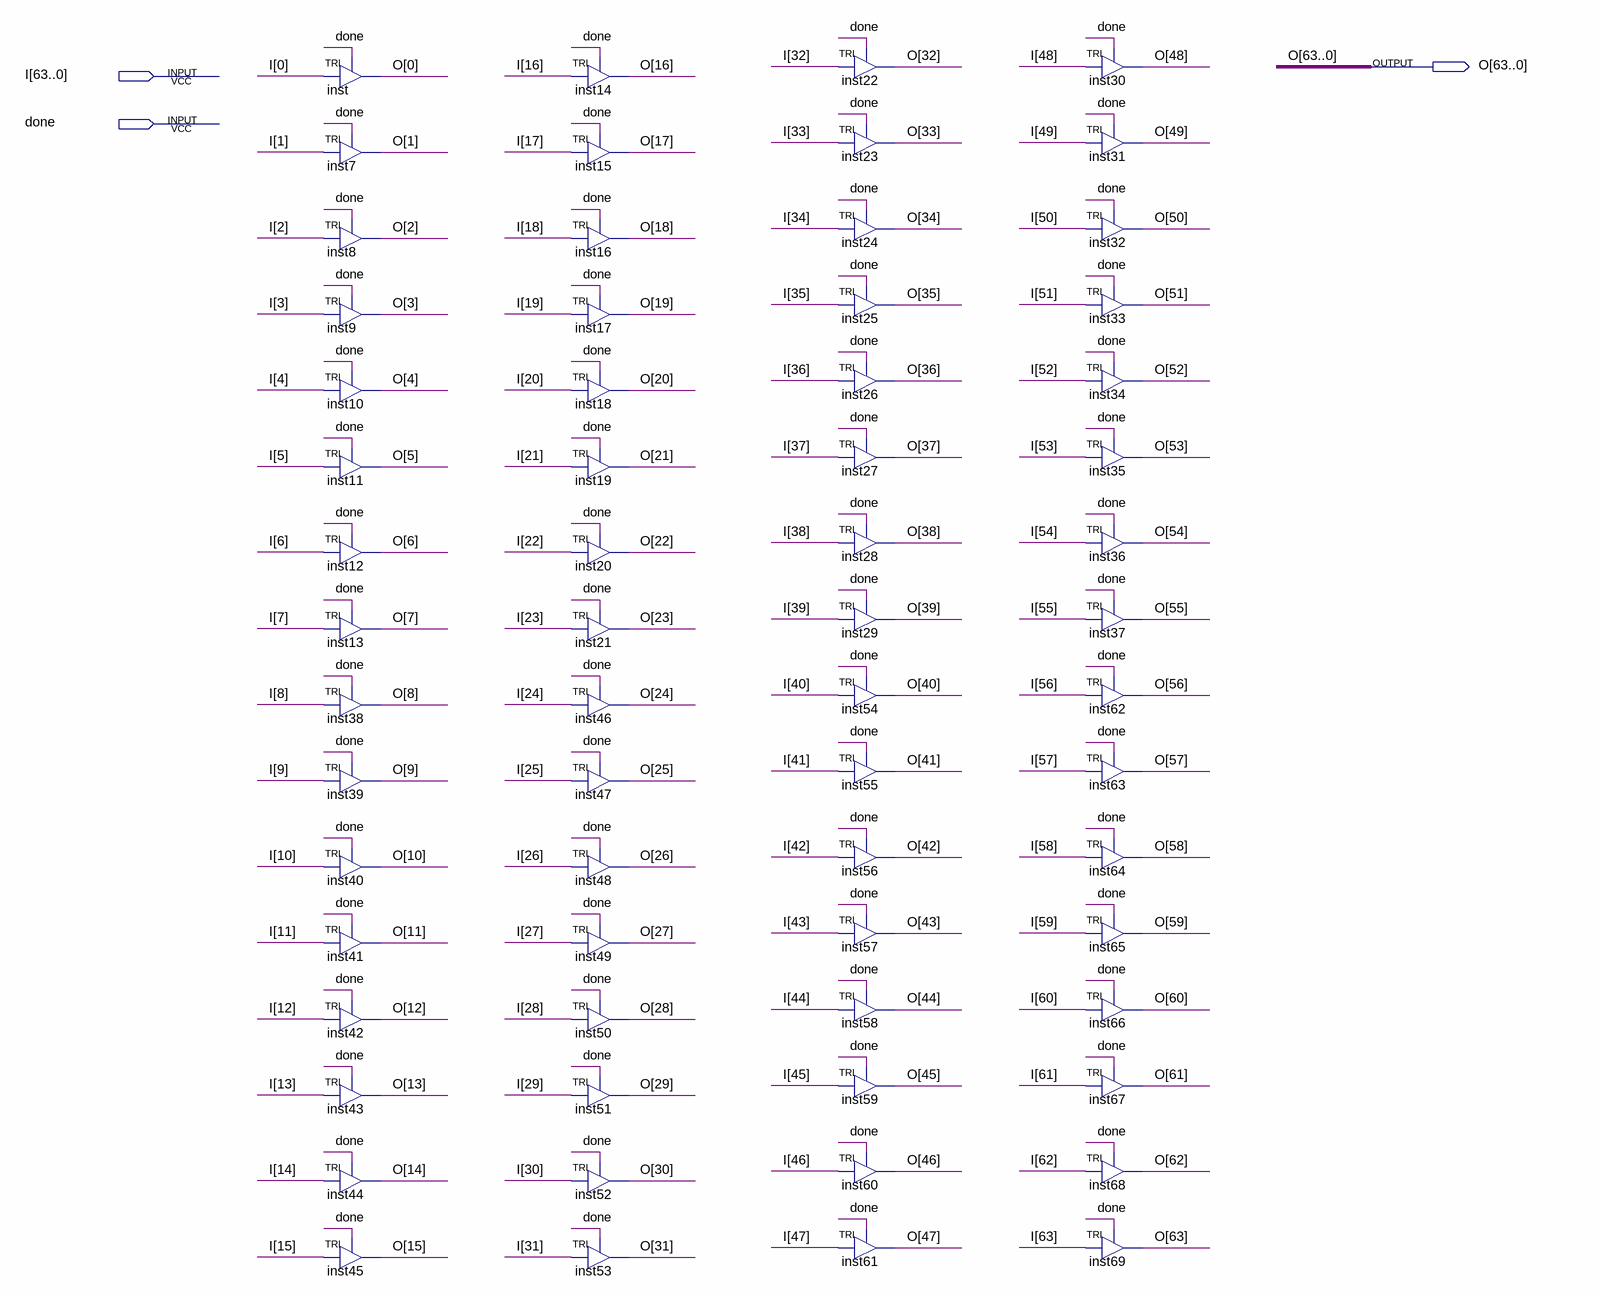
[diagram p0: schematic sheet]
// Quartus schematic TRI_64_bit.bdf as structural Verilog: 64 symbols, 3 pins
module TRI_64_bit (
  input  [63:0] I,
  input  done,
  output [63:0] O
);

  TRI inst (.IN(I[0]), .OE(done), .OUT(O[0]));
  TRI inst7 (.IN(I[1]), .OE(done), .OUT(O[1]));
  TRI inst8 (.IN(I[2]), .OE(done), .OUT(O[2]));
  TRI inst9 (.IN(I[3]), .OE(done), .OUT(O[3]));
  TRI inst10 (.IN(I[4]), .OE(done), .OUT(O[4]));
  TRI inst11 (.IN(I[5]), .OE(done), .OUT(O[5]));
  TRI inst12 (.IN(I[6]), .OE(done), .OUT(O[6]));
  TRI inst13 (.IN(I[7]), .OE(done), .OUT(O[7]));
  TRI inst38 (.IN(I[8]), .OE(done), .OUT(O[8]));
  TRI inst39 (.IN(I[9]), .OE(done), .OUT(O[9]));
  TRI inst40 (.IN(I[10]), .OE(done), .OUT(O[10]));
  TRI inst41 (.IN(I[11]), .OE(done), .OUT(O[11]));
  TRI inst42 (.IN(I[12]), .OE(done), .OUT(O[12]));
  TRI inst43 (.IN(I[13]), .OE(done), .OUT(O[13]));
  TRI inst44 (.IN(I[14]), .OE(done), .OUT(O[14]));
  TRI inst45 (.IN(I[15]), .OE(done), .OUT(O[15]));
  TRI inst14 (.IN(I[16]), .OE(done), .OUT(O[16]));
  TRI inst15 (.IN(I[17]), .OE(done), .OUT(O[17]));
  TRI inst16 (.IN(I[18]), .OE(done), .OUT(O[18]));
  TRI inst17 (.IN(I[19]), .OE(done), .OUT(O[19]));
  TRI inst18 (.IN(I[20]), .OE(done), .OUT(O[20]));
  TRI inst19 (.IN(I[21]), .OE(done), .OUT(O[21]));
  TRI inst20 (.IN(I[22]), .OE(done), .OUT(O[22]));
  TRI inst21 (.IN(I[23]), .OE(done), .OUT(O[23]));
  TRI inst46 (.IN(I[24]), .OE(done), .OUT(O[24]));
  TRI inst47 (.IN(I[25]), .OE(done), .OUT(O[25]));
  TRI inst48 (.IN(I[26]), .OE(done), .OUT(O[26]));
  TRI inst49 (.IN(I[27]), .OE(done), .OUT(O[27]));
  TRI inst50 (.IN(I[28]), .OE(done), .OUT(O[28]));
  TRI inst51 (.IN(I[29]), .OE(done), .OUT(O[29]));
  TRI inst52 (.IN(I[30]), .OE(done), .OUT(O[30]));
  TRI inst53 (.IN(I[31]), .OE(done), .OUT(O[31]));
  TRI inst22 (.IN(I[32]), .OE(done), .OUT(O[32]));
  TRI inst23 (.IN(I[33]), .OE(done), .OUT(O[33]));
  TRI inst24 (.IN(I[34]), .OE(done), .OUT(O[34]));
  TRI inst25 (.IN(I[35]), .OE(done), .OUT(O[35]));
  TRI inst26 (.IN(I[36]), .OE(done), .OUT(O[36]));
  TRI inst27 (.IN(I[37]), .OE(done), .OUT(O[37]));
  TRI inst28 (.IN(I[38]), .OE(done), .OUT(O[38]));
  TRI inst29 (.IN(I[39]), .OE(done), .OUT(O[39]));
  TRI inst54 (.IN(I[40]), .OE(done), .OUT(O[40]));
  TRI inst55 (.IN(I[41]), .OE(done), .OUT(O[41]));
  TRI inst56 (.IN(I[42]), .OE(done), .OUT(O[42]));
  TRI inst57 (.IN(I[43]), .OE(done), .OUT(O[43]));
  TRI inst58 (.IN(I[44]), .OE(done), .OUT(O[44]));
  TRI inst59 (.IN(I[45]), .OE(done), .OUT(O[45]));
  TRI inst60 (.IN(I[46]), .OE(done), .OUT(O[46]));
  TRI inst61 (.IN(I[47]), .OE(done), .OUT(O[47]));
  TRI inst30 (.IN(I[48]), .OE(done), .OUT(O[48]));
  TRI inst31 (.IN(I[49]), .OE(done), .OUT(O[49]));
  TRI inst32 (.IN(I[50]), .OE(done), .OUT(O[50]));
  TRI inst33 (.IN(I[51]), .OE(done), .OUT(O[51]));
  TRI inst34 (.IN(I[52]), .OE(done), .OUT(O[52]));
  TRI inst35 (.IN(I[53]), .OE(done), .OUT(O[53]));
  TRI inst36 (.IN(I[54]), .OE(done), .OUT(O[54]));
  TRI inst37 (.IN(I[55]), .OE(done), .OUT(O[55]));
  TRI inst62 (.IN(I[56]), .OE(done), .OUT(O[56]));
  TRI inst63 (.IN(I[57]), .OE(done), .OUT(O[57]));
  TRI inst64 (.IN(I[58]), .OE(done), .OUT(O[58]));
  TRI inst65 (.IN(I[59]), .OE(done), .OUT(O[59]));
  TRI inst66 (.IN(I[60]), .OE(done), .OUT(O[60]));
  TRI inst67 (.IN(I[61]), .OE(done), .OUT(O[61]));
  TRI inst68 (.IN(I[62]), .OE(done), .OUT(O[62]));
  TRI inst69 (.IN(I[63]), .OE(done), .OUT(O[63]));
endmodule
